# EAGLE design Phase 3.1. Form Factor 1 (EAGLE 9.6.2)
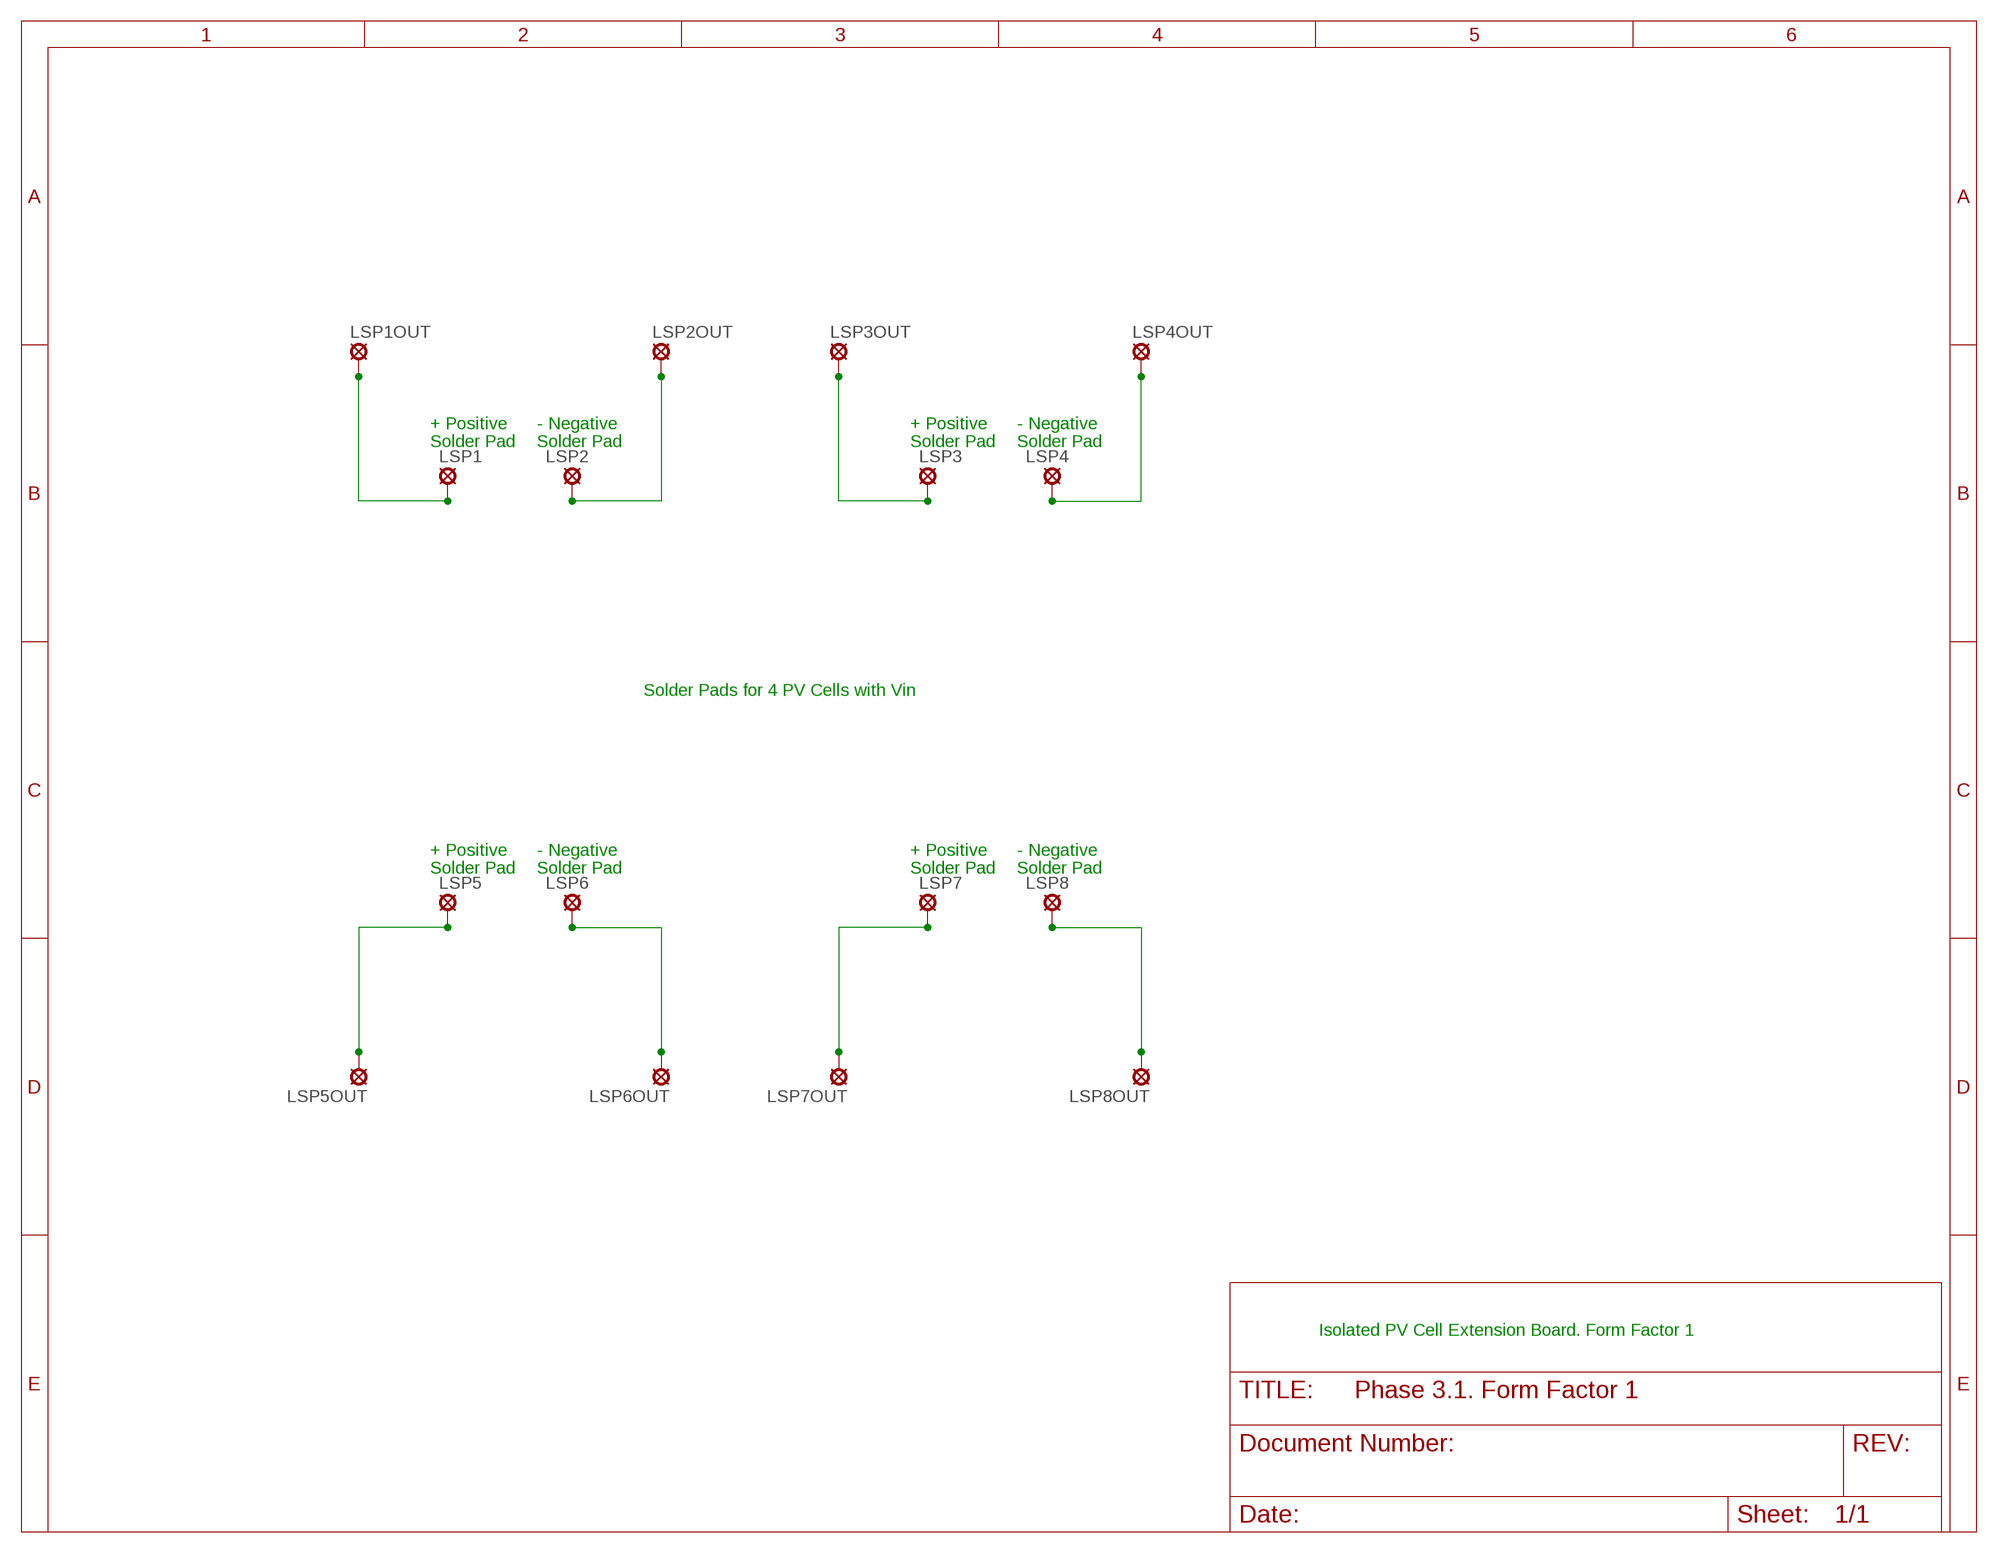
[diagram p0: schematic, sheet 1]

## Parts
LSP1  LSP10  [LSP10]
LSP1OUT  LSP10  [LSP10]
LSP2  LSP10  [LSP10]
LSP2OUT  LSP10  [LSP10]
LSP3  LSP10  [LSP10]
LSP3OUT  LSP10  [LSP10]
LSP4  LSP10  [LSP10]
LSP4OUT  LSP10  [LSP10]
LSP5  LSP10  [LSP10]
LSP5OUT  LSP10  [LSP10]
LSP6  LSP10  [LSP10]
LSP6OUT  LSP10  [LSP10]
LSP7  LSP10  [LSP10]
LSP7OUT  LSP10  [LSP10]
LSP8  LSP10  [LSP10]
LSP8OUT  LSP10  [LSP10]

## Nets
N$1: LSP1.MP LSP1OUT.MP
N$2: LSP2.MP LSP2OUT.MP
N$3: LSP3.MP LSP3OUT.MP
N$4: LSP4.MP LSP4OUT.MP
N$5: LSP5.MP LSP5OUT.MP
N$6: LSP6.MP LSP6OUT.MP
N$7: LSP7.MP LSP7OUT.MP
N$8: LSP8.MP LSP8OUT.MP

## Notes on the sheet
- + Positive | - Negative | + Positive | - Negative
- Solder Pad | Solder Pad | Solder Pad | Solder Pad
- Solder Pads for 4 PV Cells with Vin
- + Positive | - Negative | + Positive | - Negative
- Solder Pad | Solder Pad | Solder Pad | Solder Pad
- Isolated PV Cell Extension Board. Form Factor 1

## Library data of the parts
LSP1 LSP1OUT LSP2 LSP2OUT LSP3 LSP3OUT LSP4 LSP4OUT LSP5 LSP5OUT LSP6 LSP6OUT LSP7 LSP7OUT LSP8 LSP8OUT = solpad:LSP10: SOLDER PAD drill 1.0 mm, distributor Buerklin, 12H555

## Board
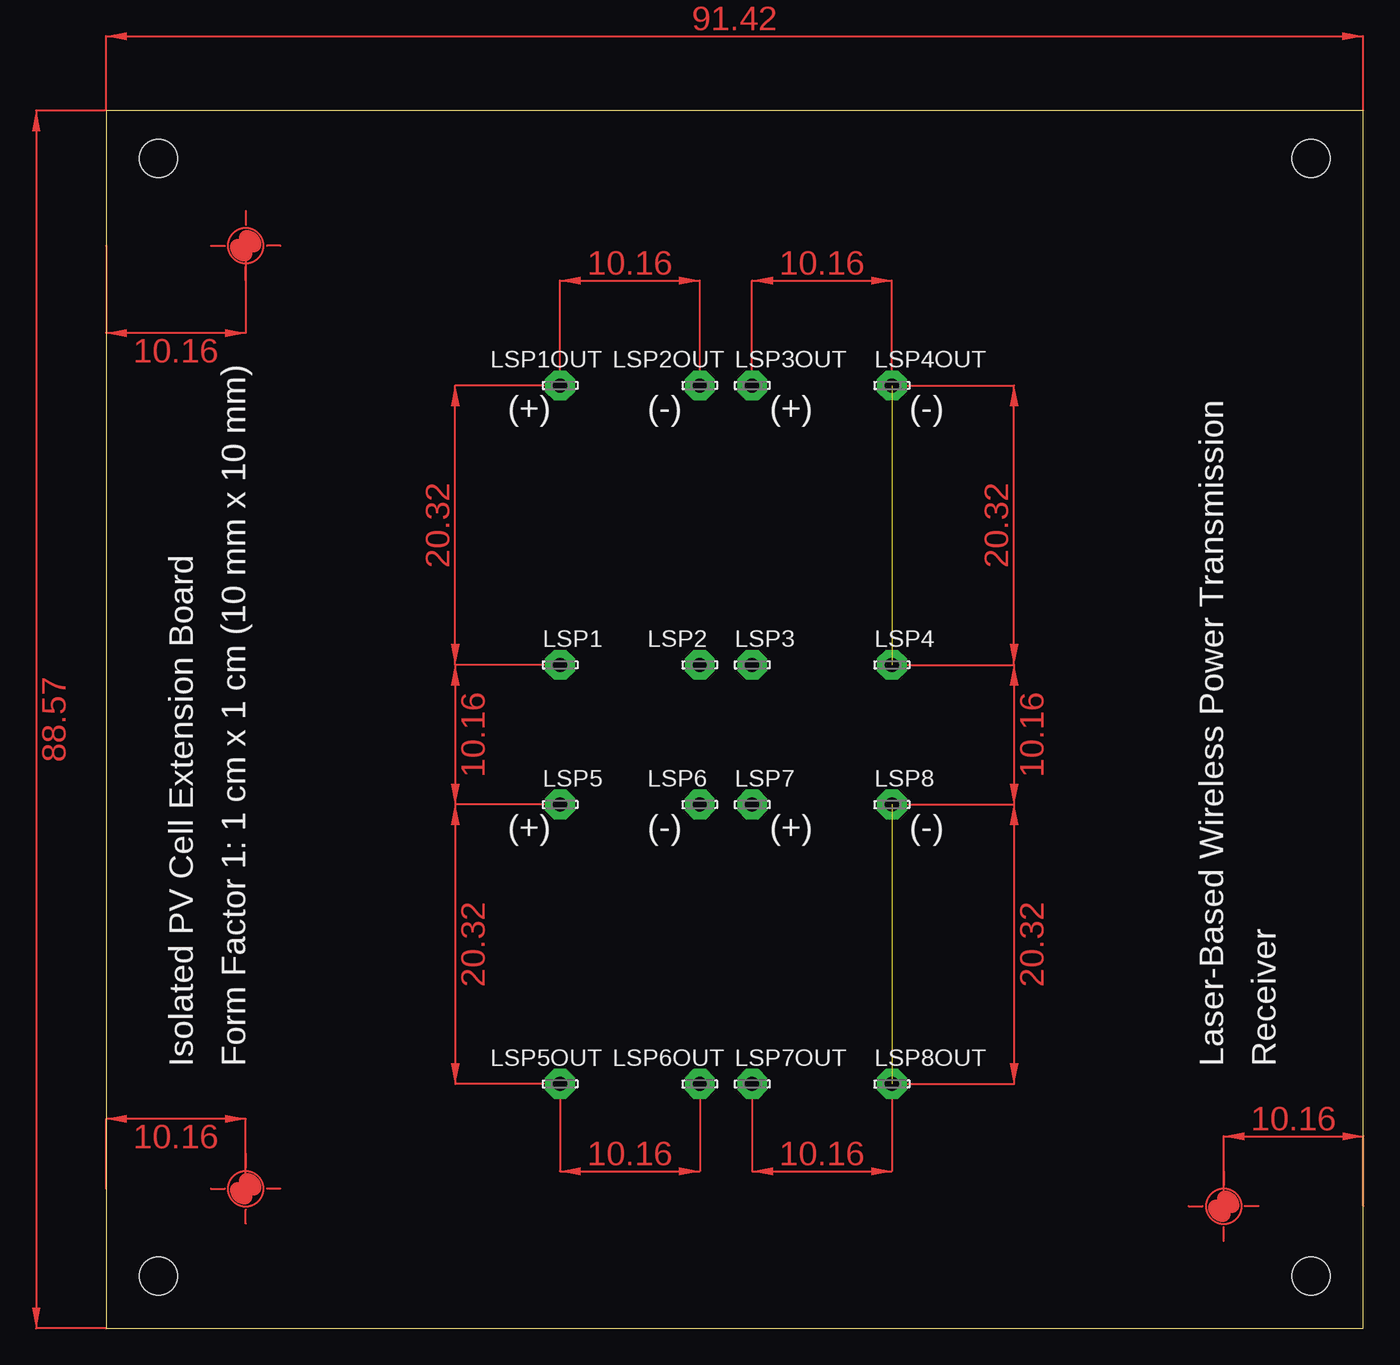
[diagram p1: board, top side]
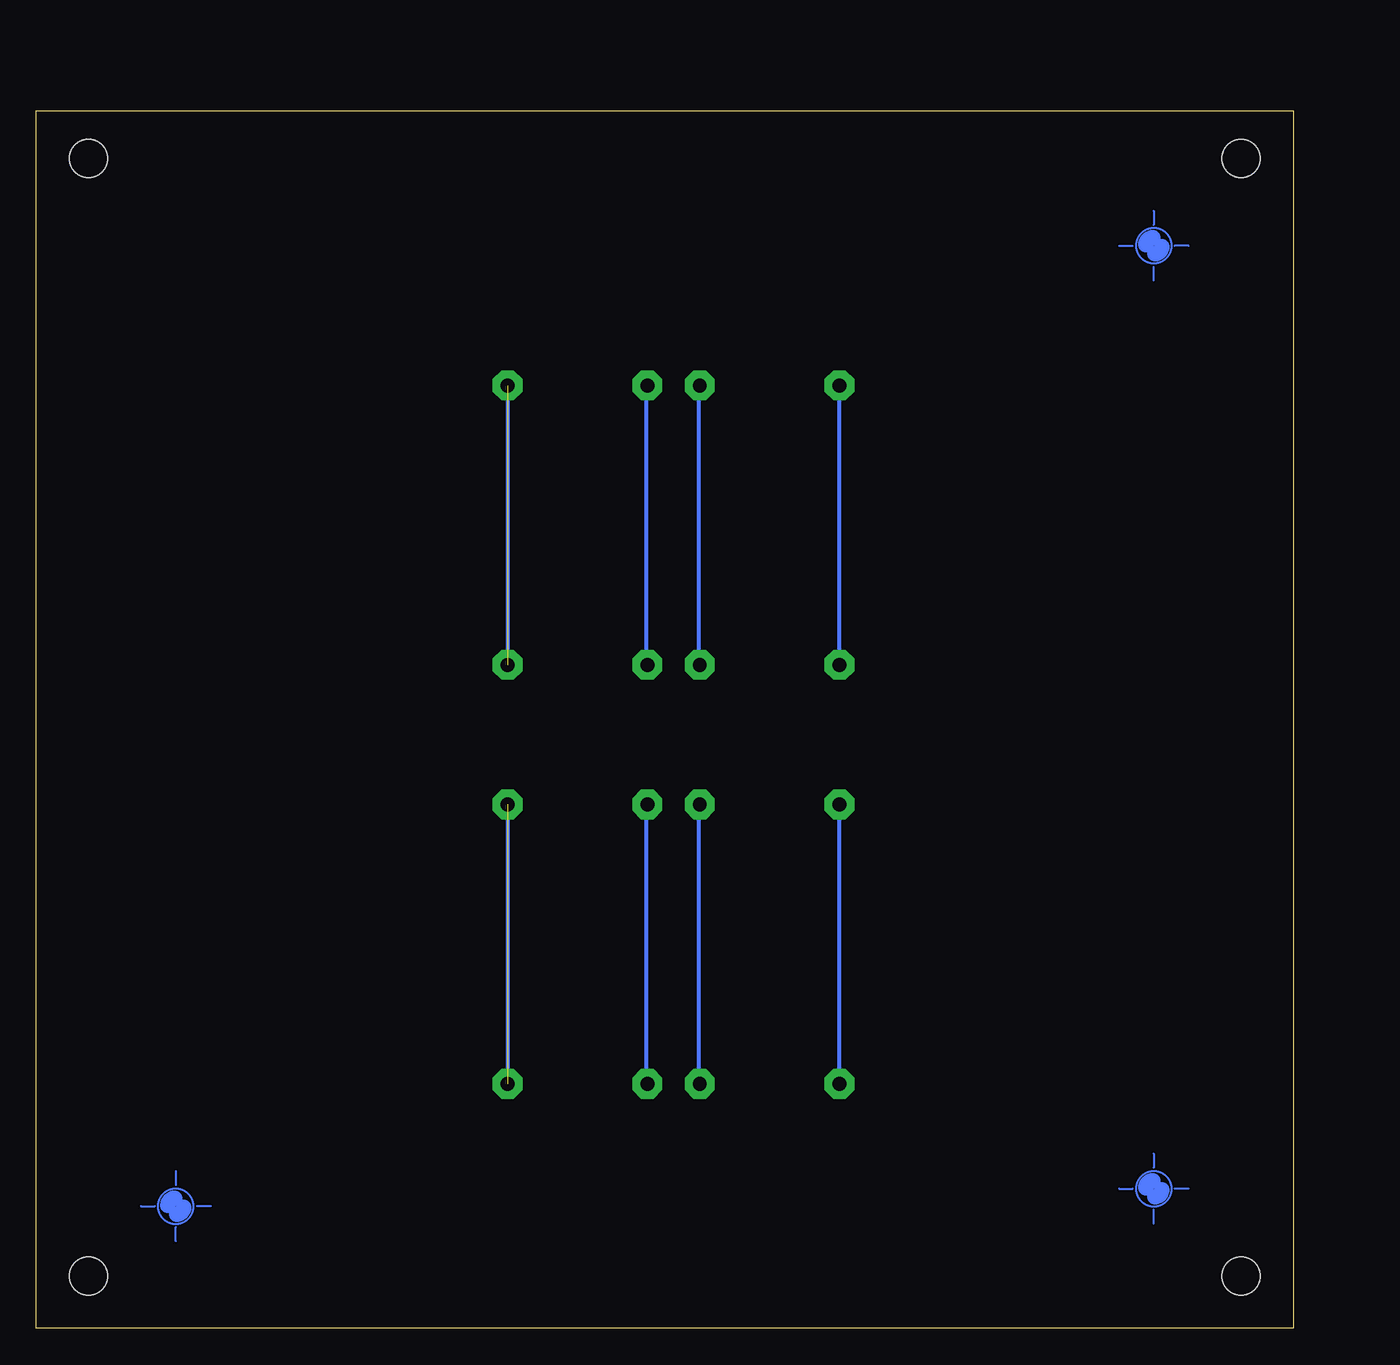
[diagram p2: board, bottom side, seen from below]

Size 91.42 x 88.57 mm. Coordinates in mm from the lower left corner, seen from the top.
Outline: 0,0 91.42,0 91.42,88.57 0,88.57 0,0
Copper layers (1*16): Top 0.035mm / dielectric 1.5mm / Bottom 0.035mm
Design rules "default": minimum track width 6mil, minimum drill 0.35mm, track to track 6mil, track to pad 6mil, pad to pad 6mil, via to via 6mil, smd to smd 6mil, copper to edge 40mil, drill to drill 6mil, minimum pad ring 10mil, minimum via ring 8mil, stop-mask expansion 4mil, vias tented up to drill 0mil, thermal gap 10mil

### Footprints (pad centres in the part's own frame; a part is rotated, then mirrored left to right if it is on the bottom)
LSP10 = drill 1.016 pad 2.159 octagon: MP 0,0
MOUNTHOLE_110MIL = hole 2.794: 0,0

### Placement (x,y rotation side)
LSP1  33.02,48.26 0 top
LSP1OUT  33.02,68.58 0 top
LSP2  43.18,48.26 0 top
LSP2OUT  43.18,68.58 0 top
LSP3  46.99,48.26 0 top
LSP3OUT  46.99,68.58 0 top
LSP4  57.15,48.26 0 top
LSP4OUT  57.15,68.58 0 top
LSP5  33.02,38.1 0 top
LSP5OUT  33.02,17.78 0 top
LSP6  43.18,38.1 0 top
LSP6OUT  43.18,17.78 0 top
LSP7  46.99,38.1 0 top
LSP7OUT  46.99,17.78 0 top
LSP8  57.15,38.1 0 top
LSP8OUT  57.15,17.78 0 top
STAND1  [MOUNTHOLE_110MIL]  3.81,3.81 0 top
STAND2  [MOUNTHOLE_110MIL]  87.63,85.09 0 top
STAND3  [MOUNTHOLE_110MIL]  87.63,3.81 0 top
STAND4  [MOUNTHOLE_110MIL]  3.81,85.09 0 top
U$1  [PASS-ROUND]  10.16,78.74 0 top
U$2  [PASS-ROUND]  10.16,10.16 0 top
U$3  [PASS-ROUND]  81.28,8.89 0 top

### Tracks (layer width: path | path; a pad name or v marks a point on that pad's centre or on a via)
N$1
  Bottom 0.152: 33.07,48.26 LSP1.MP | 33.07,68.48 LSP1OUT.MP
  Bottom 0.305: 33.07,68.48 33.07,48.26
N$2
  Bottom 0.152: 43.28,48.26 LSP2.MP | 43.28,68.48 LSP2OUT.MP
  Bottom 0.305: 43.28,68.48 43.28,48.26
N$3
  Bottom 0.152: 47.09,48.26 LSP3.MP | 47.09,68.48 LSP3OUT.MP
  Bottom 0.305: 47.09,68.48 47.09,48.26
N$4  (2 unrouted)
  Bottom 0.305: LSP4OUT.MP LSP4.MP
N$5
  Bottom 0.152: 33.07,17.83 LSP5OUT.MP | 33.07,38.05 LSP5.MP
  Bottom 0.305: 33.07,38.05 33.07,17.83
N$6
  Bottom 0.152: 43.28,17.83 LSP6OUT.MP | 43.28,38.05 LSP6.MP
  Bottom 0.305: 43.28,38.05 43.28,17.83
N$7
  Bottom 0.152: 47.09,17.83 LSP7OUT.MP | 47.09,38.05 LSP7.MP
  Bottom 0.305: 47.09,38.05 47.09,17.83
N$8  (2 unrouted)
  Bottom 0.305: LSP8.MP LSP8OUT.MP
(copper drawn outside any net)
  shapes: Top area x15

### Text on the board
tNames: (+) | (-) | (+) | (-) | (+) | (-) | (+) | (-) | Isolated PV Cell Extension Board | Form Factor 1: 1 cm x 1 cm (10 mm x 10 mm) | Laser-Based Wireless Power Transmission | Receiver